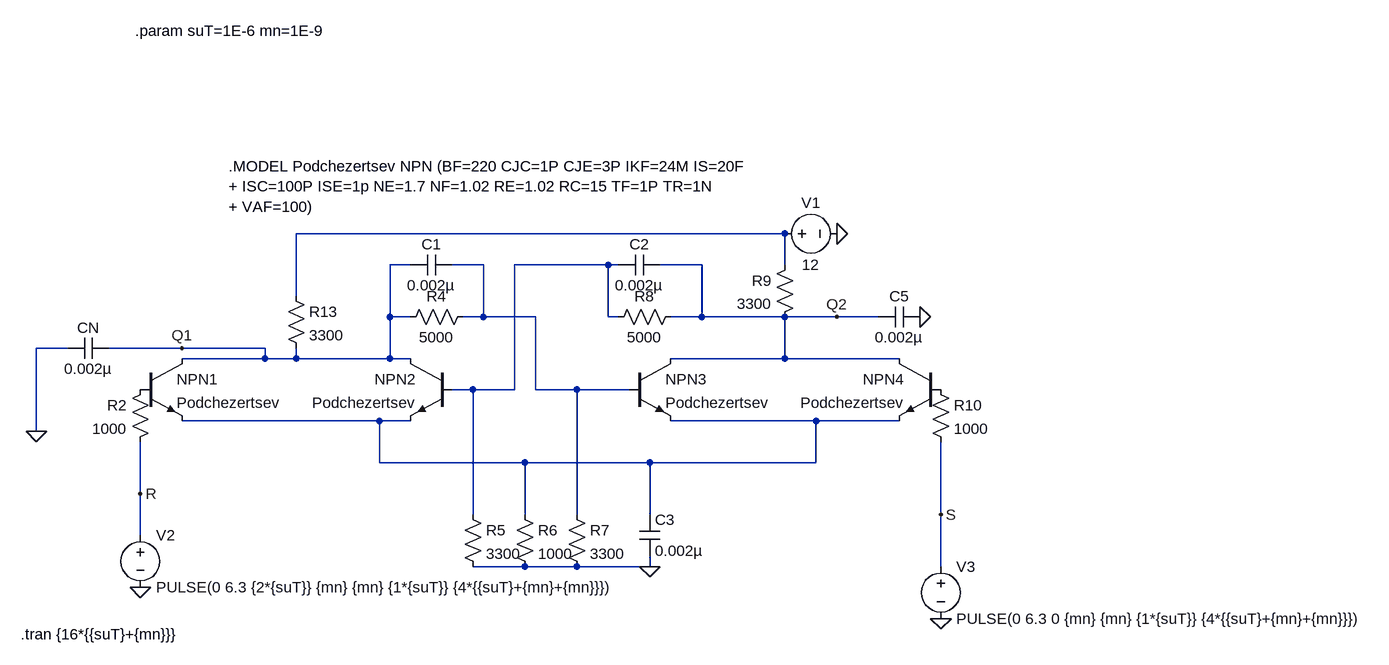
[diagram p0: schematic Trigger_2.asc]
Trigger_2.asc, the LTspice schematic file:
Version 4
SHEET 1 1940 776
WIRE 832 144 80 144
WIRE 256 192 224 192
WIRE 368 192 320 192
WIRE 560 192 416 192
WIRE 576 192 560 192
WIRE 704 192 640 192
WIRE 832 192 832 144
WIRE 80 240 80 144
WIRE 224 272 224 192
WIRE 256 272 224 272
WIRE 368 272 368 192
WIRE 368 272 336 272
WIRE 448 272 368 272
WIRE 560 272 560 192
WIRE 576 272 560 272
WIRE 704 272 704 192
WIRE 704 272 656 272
WIRE 832 272 704 272
WIRE 912 272 832 272
WIRE 976 272 912 272
WIRE -272 320 -320 320
WIRE -96 320 -208 320
WIRE 32 320 -96 320
WIRE 32 336 32 320
WIRE 32 336 -96 336
WIRE 80 336 80 320
WIRE 80 336 32 336
WIRE 224 336 224 272
WIRE 224 336 80 336
WIRE 256 336 224 336
WIRE 832 336 832 272
WIRE 832 336 656 336
WIRE 1008 336 832 336
WIRE 352 384 320 384
WIRE 416 384 416 192
WIRE 416 384 352 384
WIRE 448 384 448 272
WIRE 512 384 448 384
WIRE 592 384 512 384
WIRE 208 432 -96 432
WIRE 256 432 208 432
WIRE 880 432 656 432
WIRE 1008 432 880 432
WIRE -320 448 -320 320
WIRE 208 496 208 432
WIRE 432 496 208 496
WIRE 624 496 432 496
WIRE 880 496 880 432
WIRE 880 496 624 496
WIRE -160 544 -160 464
WIRE 352 576 352 384
WIRE 432 576 432 496
WIRE 512 576 512 384
WIRE 624 576 624 496
WIRE 1072 576 1072 464
WIRE -160 608 -160 544
WIRE 432 656 352 656
WIRE 512 656 432 656
WIRE 624 656 624 640
WIRE 624 656 512 656
WIRE 1072 656 1072 576
FLAG 1040 272 0
FLAG 624 656 0
FLAG -160 544 R
FLAG 1072 576 S
FLAG -320 448 0
FLAG 912 144 0
FLAG 912 272 Q2
FLAG -96 320 Q1
FLAG -160 688 0
FLAG 1072 736 0
SYMBOL npn -160 336 R0
SYMATTR InstName NPN1
SYMATTR Value Podchezertsev
SYMBOL npn 320 336 M0
SYMATTR InstName NPN2
SYMATTR Value Podchezertsev
SYMBOL npn 592 336 R0
SYMATTR InstName NPN3
SYMATTR Value Podchezertsev
SYMBOL npn 1072 336 M0
SYMATTR InstName NPN4
SYMATTR Value Podchezertsev
SYMBOL res -144 368 M0
SYMATTR InstName R2
SYMATTR Value 1000
SYMBOL res 336 560 R0
SYMATTR InstName R5
SYMATTR Value 3300
SYMBOL res 416 560 R0
SYMATTR InstName R6
SYMATTR Value 1000
SYMBOL res 496 560 R0
SYMATTR InstName R7
SYMATTR Value 3300
SYMBOL cap 608 576 R0
SYMATTR InstName C3
SYMATTR Value 0.002µ
SYMBOL res 1056 368 R0
SYMATTR InstName R10
SYMATTR Value 1000
SYMBOL res 64 224 R0
SYMATTR InstName R13
SYMATTR Value 3300
SYMBOL res 352 256 R90
WINDOW 0 0 56 VBottom 2
WINDOW 3 32 56 VTop 2
SYMATTR InstName R4
SYMATTR Value 5000
SYMBOL cap 320 176 R90
WINDOW 0 0 32 VBottom 2
WINDOW 3 32 32 VTop 2
SYMATTR InstName C1
SYMATTR Value 0.002µ
SYMBOL res 672 256 R90
WINDOW 0 0 56 VBottom 2
WINDOW 3 32 56 VTop 2
SYMATTR InstName R8
SYMATTR Value 5000
SYMBOL cap 640 176 R90
WINDOW 0 0 32 VBottom 2
WINDOW 3 32 32 VTop 2
SYMATTR InstName C2
SYMATTR Value 0.002µ
SYMBOL cap -208 304 R90
WINDOW 0 0 32 VBottom 2
WINDOW 3 32 32 VTop 2
SYMATTR InstName CN
SYMATTR Value 0.002µ
SYMBOL res 848 176 M0
SYMATTR InstName R9
SYMATTR Value 3300
SYMBOL cap 976 256 M90
WINDOW 0 0 32 VBottom 2
WINDOW 3 32 32 VTop 2
SYMATTR InstName C5
SYMATTR Value 0.002µ
SYMBOL voltage 816 144 R270
WINDOW 0 32 56 VTop 2
WINDOW 3 -32 56 VBottom 2
WINDOW 123 0 0 Left 0
WINDOW 39 0 0 Left 0
SYMATTR InstName V1
SYMATTR Value 12
SYMBOL voltage -160 592 R0
WINDOW 123 0 0 Left 0
WINDOW 39 0 0 Left 0
SYMATTR InstName V2
SYMATTR Value PULSE(0 6.3 {2*{suT}} {mn} {mn} {1*{suT}} {4*{{suT}+{mn}+{mn}}})
SYMBOL voltage 1072 640 R0
WINDOW 123 0 0 Left 0
WINDOW 39 0 0 Left 0
SYMATTR InstName V3
SYMATTR Value PULSE(0 6.3 0 {mn} {mn} {1*{suT}} {4*{{suT}+{mn}+{mn}}})
TEXT -24 40 Left 2 !.MODEL Podchezertsev NPN (BF=220 CJC=1P CJE=3P IKF=24M IS=20F\n+ ISC=100P ISE=1p NE=1.7 NF=1.02 RE=1.02 RC=15 TF=1P TR=1N\n+ VAF=100)
TEXT -344 760 Left 2 !.tran {16*{{suT}+{mn}}}
TEXT -168 -168 Left 2 !.param suT=1E-6 mn=1E-9

The netlist it stands for:
* Trigger_2.asc
Q§NPN1 Q1 P001 N004 0 Podchezertsev
Q§NPN2 Q1 N003 N004 0 Podchezertsev
Q§NPN3 Q2 N002 N004 0 Podchezertsev
Q§NPN4 Q2 P002 N004 0 Podchezertsev
R2 P001 R 1000
R5 N003 0 3300
R6 N004 0 1000
R7 N002 0 3300
C3 N004 0 0.002µ
R10 P002 S 1000
R13 N001 Q1 3300
R4 N002 Q1 5000
C1 N002 Q1 0.002µ
R8 Q2 N003 5000
C2 Q2 N003 0.002µ
CN Q1 0 0.002µ
R9 N001 Q2 3300
C5 Q2 0 0.002µ
V1 N001 0 12
V2 R 0 PULSE(0 6.3 {2*{suT}} {mn} {mn} {1*{suT}} {4*{{suT}+{mn}+{mn}}})
V3 S 0 PULSE(0 6.3 0 {mn} {mn} {1*{suT}} {4*{{suT}+{mn}+{mn}}})
.model NPN NPN
.model PNP PNP
.lib standard.bjt
.MODEL Podchezertsev NPN (BF=220 CJC=1P CJE=3P IKF=24M IS=20F
+ ISC=100P ISE=1p NE=1.7 NF=1.02 RE=1.02 RC=15 TF=1P TR=1N
+ VAF=100)
.tran {16*{{suT}+{mn}}}
.param suT=1E-6 mn=1E-9
.backanno
.end